# EAGLE design HM_SHT21 (EAGLE 9.5.0)
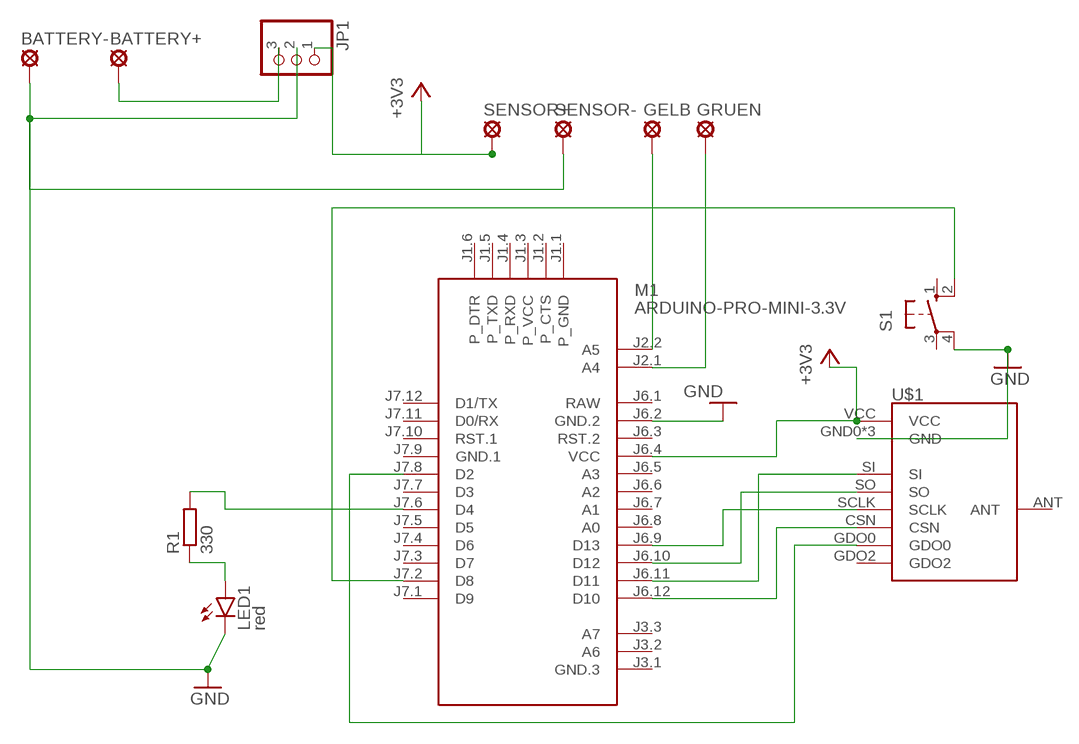
[diagram p0: schematic, sheet 1]

## Parts
BATTERY+  LSP11  [LSP11]
BATTERY-  LSP11  [LSP11]
GELB  LSP11  [LSP11]
GRUEN  LSP11  [LSP11]
JP1  PINHD-1X3  [1X03]
LED1  red  LED5MM  [LED5MM]
M1  ARDUINO-PRO-MINI-3.3V  [ARDUINO-PRO-MINI]
R1  330  R-EU_0204/7  [0204/7]
S1  10-XX  [B3F-10XX]
SENSOR+  LSP11  [LSP11]
SENSOR-  LSP11  [LSP11]
U$1  CC1101  [CC1101]

## Nets
+3V3: JP1.1 M1.J6.4(VCC) SENSOR+.MP U$1.VCC
GND: BATTERY-.MP JP1.2 LED1.K(C) M1.J6.2(GND.2) S1.4(P1) SENSOR-.MP U$1.GND0(GND) U$1.GND1(GND) U$1.GND2(GND)
N$1: M1.J6.12(D10) U$1.CSN
N$2: M1.J7.8(D2) U$1.GDO0
N$3: M1.J6.11(D11) U$1.SI
N$4: M1.J6.10(D12) U$1.SO
N$5: M1.J6.9(D13) U$1.SCLK
N$7: LED1.A R1.1
N$8: M1.J7.2(D8) S1.2(S1)
N$9: M1.J7.6(D4) R1.2
N$11: GELB.MP M1.J2.2(A5)
N$12: GRUEN.MP M1.J2.1(A4)
VIN: BATTERY+.MP JP1.3
Unconnected: M1.J1.1(P_GND) M1.J1.2(P_CTS) M1.J1.3(P_VCC) M1.J1.4(P_RXD) M1.J1.5(P_TXD) M1.J1.6(P_DTR) M1.J3.1(GND.3) M1.J3.2(A6) M1.J3.3(A7) M1.J6.3(RST.2) M1.J6.5(A3) M1.J6.6(A2) M1.J6.7(A1) M1.J6.8(A0) M1.J7.1(D9) M1.J7.3(D7) M1.J7.4(D6) M1.J7.5(D5) M1.J7.7(D3) M1.J7.10(RST.1) M1.J7.11(D0/RX) M1.J7.12(D1/TX) S1.1(S) S1.3(P) U$1.ANT U$1.GDO2

## Power pins joined to a net without a drawn wire
GND.1: M1.J7.9(GND.1)
RAW: M1.J6.1(RAW)

## Library data of the parts
BATTERY+ BATTERY- GELB GRUEN SENSOR+ SENSOR- = solpad:LSP11: SOLDER PAD drill 1.1 mm
JP1 = pinhead:PINHD-1X3: PIN HEADER
LED1 = led:LED: LED OSRAM: - CHIPLED LG R971, LG N971, LY N971, LG Q971, LY Q971, LO R971, LY R971 LH N974, LH R974 LS Q976, LO Q976, LY Q976 LO Q996 - Hyper CHIPLED LW Q18S LB Q993, LB Q99A, LB R99A - SideLED LS A670, LO A670, LY A670, LG A670, LP A670 LB A673, LV A673, LT A673, LW A673 LH A674 LY A675 LS A676, LA A676, LO A676, LY A676, LW A676 LS A679, LY A679, LG A679 - Hyper Micro SIDELED® LS Y876, LA Y876, LO Y876, LY Y876 LT Y87S - SmartLED LW L88C, LW L88S LB L89C, LB L89S, LG L890 LS L89K, LO L89K, LY L89K LS L896, LA L896, LO L896, LY L896 - TOPLED LS T670, LO T670, LY T670, LG T670, LP T670 LSG T670, LSP T670, LSY T670, LOP T670, LYG T670 LG T671, LOG T671, LSG T671 LB T673, LV T673, LT T673, LW T673 LH T674 LS T676, LA T676, LO T676, LY T676, LB T676, LH T676, LSB T676, LW T676 LB T67C, LV T67C, LT T67C, LS T67K, LO T67K, LY T67K, LW E67C LS E67B, LA E67B, LO E67B, LY E67B, LB E67C, LV E67C, LT E67C LW T67C LS T679, LY T679, LG T679 LS T770, LO T770, LY T770, LG T770, LP T770 LB T773, LV T773, LT T773, LW T773 LH T774 LS E675, LA E675, LY E675, LS T675 LS T776, LA T776, LO T776, LY T776, LB T776 LHGB T686 LT T68C, LB T68C - Hyper Mini TOPLED® LB M676 - Mini TOPLED Santana® LG M470 LS M47K, LO M47K, LY M47K Source: http://www.osram.convergy.de LUXEON: - LUMILED® LXK2-PW12-R00, LXK2-PW12-S00, LXK2-PW14-U00, LXK2-PW14-V00 LXK2-PM12-R00, LXK2-PM12-S00, LXK2-PM14-U00 LXK2-PE12-Q00, LXK2-PE12-R00, LXK2-PE12-S00, LXK2-PE14-T00, LXK2-PE14-U00 LXK2-PB12-K00, LXK2-PB12-L00, LXK2-PB12-M00, LXK2-PB14-N00, LXK2-PB14-P00, LXK2-PB14-Q00 LXK2-PR12-L00, LXK2-PR12-M00, LXK2-PR14-Q00, LXK2-PR14-R00 LXK2-PD12-Q00, LXK2-PD12-R00, LXK2-PD12-S00 LXK2-PH12-R00, LXK2-PH12-S00 LXK2-PL12-P00, LXK2-PL12-Q00, LXK2-PL12-R00 Source: www.luxeon.com KINGBRIGHT: KA-3528ASYC Source: www.kingbright.com
M1 = diy-modules:ARDUINO-PRO-MINI-*: Arduino Pro Mini and compatible devices More details available here: https://www.arduino.cc/en/Main/ArduinoBoardProMini Click here to find device on ebay.com <http://www.ebay.com/sch/arduino+pro+mini>
R1 = rcl:R-EU_: RESISTOR, European symbol; SPICEPREFIX: R
S1 = switch-omron:10-XX: OMRON SWITCH; MPN: B3F-1000; OC_FARNELL: 176432; OC_NEWARK: 36M3542
U$1 = modules:CC1101

## Net classes
0 default: clearance 0.205 mm

## Board
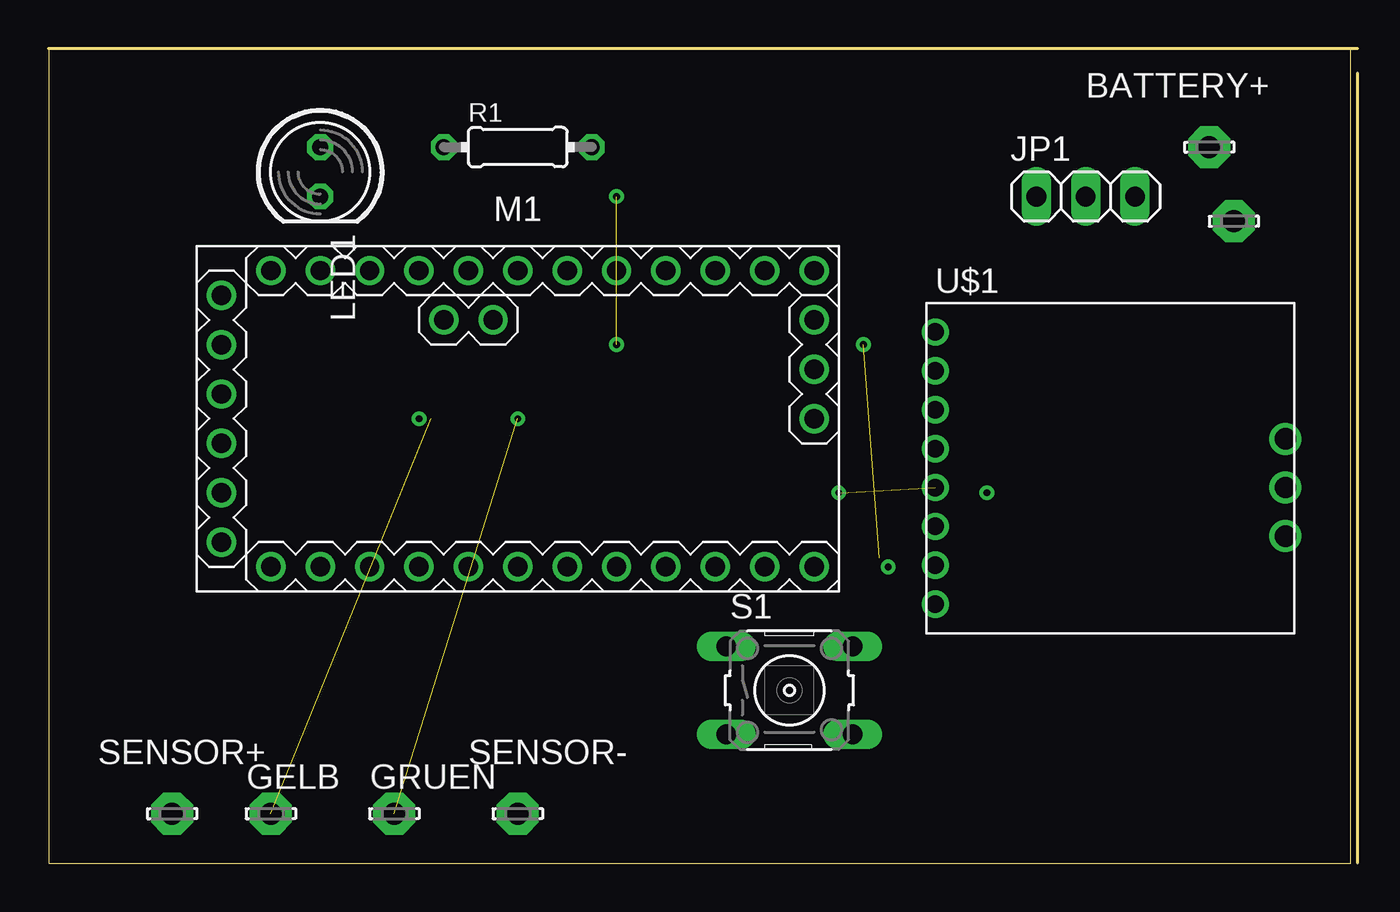
[diagram p1: board, top side]
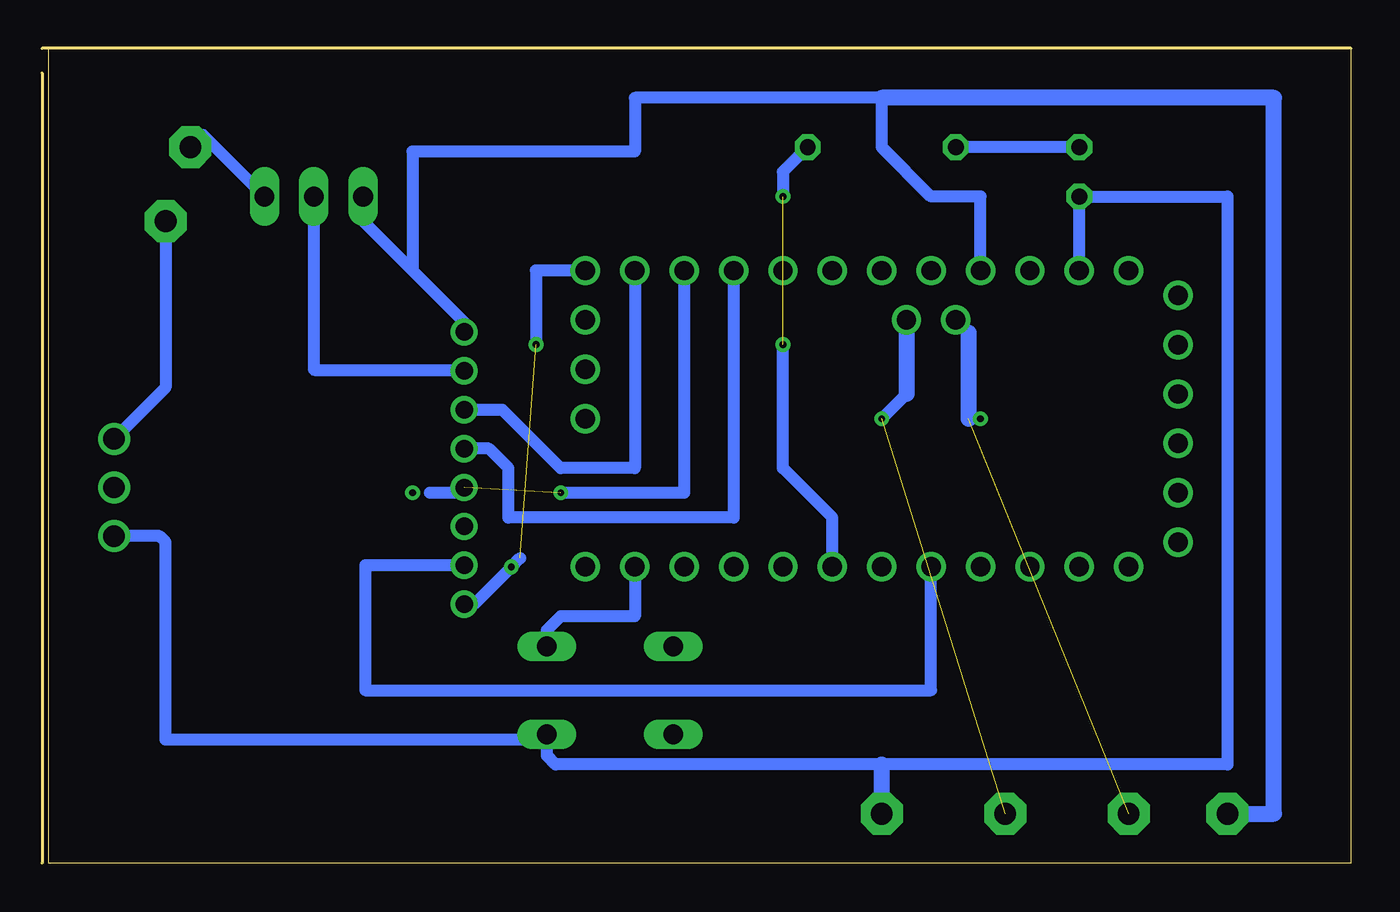
[diagram p2: board, bottom side, seen from below]

Size 66.98 x 41.9 mm. Coordinates in mm from the lower left corner, seen from the top.
Outline: 0,0 66.98,0 66.98,41.9 0,41.9 0,0
Copper layers (1*16): Top 0.035mm / dielectric 1.5mm / Bottom 0.035mm
Design rules "default *": minimum track width 6mil, minimum drill 0.35mm, track to track 10mil, track to pad 10mil, pad to pad 10mil, via to via 10mil, smd to smd 6mil, copper to edge 40mil, drill to drill 6mil, minimum pad ring 10mil, minimum via ring 8mil, stop-mask expansion 4mil, vias tented up to drill 0mil, thermal gap 10mil
Milling: 2 lines

### Footprints (pad centres in the part's own frame; a part is rotated, then mirrored left to right if it is on the bottom)
LSP11 = drill 1.118 pad 2.159 octagon: MP 0,0
1X03 = drill 1.016 long: 1 -2.54,0; 2 0,0; 3 2.54,0
LED5MM = drill 0.813 octagon: A -1.27,0; K 1.27,0
ARDUINO-PRO-MINI = drill 1: J1.1 -15.24,6.35; J1.2 -15.24,3.81; J1.3 -15.24,1.27; J1.4 -15.24,-1.27; J1.5 -15.24,-3.81; J1.6 -15.24,-6.35; J2.1 -1.27,5.08; J2.2 -3.81,5.08; J3.1 15.24,0; J3.2 15.24,2.54; J3.3 15.24,5.08; J6.1 -12.7,7.62; J6.2 -10.16,7.62; J6.3 -7.62,7.62; J6.4 -5.08,7.62; J6.5 -2.54,7.62; J6.6 0,7.62; J6.7 2.54,7.62; J6.8 5.08,7.62; J6.9 7.62,7.62; J6.10 10.16,7.62; J6.11 12.7,7.62; J6.12 15.24,7.62; J7.1 15.24,-7.62; J7.2 12.7,-7.62; J7.3 10.16,-7.62; J7.4 7.62,-7.62; J7.5 5.08,-7.62; J7.6 2.54,-7.62; J7.7 0,-7.62; J7.8 -2.54,-7.62; J7.9 -5.08,-7.62; J7.10 -7.62,-7.62; J7.11 -10.16,-7.62; J7.12 -12.7,-7.62
0204/7 = drill 0.813 octagon: 1 -3.81,0; 2 3.81,0
B3F-10XX = drill 1.016 long: 1 -3.251,2.261; 2 3.251,2.261; 3 -3.251,-2.261; 4 3.251,-2.261
CC1101 = drill 1.1: ANT 9,-1; GND1 9,-3.5; GND2 9,1.5 | drill 0.9: CSN -9,-7; GDO0 -9,-5; GDO2 -9,-3; GND0 -9,5; SCLK -9,1; SI -9,3; SO -9,-1; VCC -9,7

### Placement (x,y rotation side)
BATTERY+  59.69,36.83 0 top
BATTERY-  60.96,33.02 0 top
GELB  11.43,2.54 0 top
GRUEN  17.78,2.54 0 top
JP1  53.34,34.29 0 top
LED1  13.97,35.56 270 top
M1  24.13,22.86 0 top
R1  24.13,36.83 0 top
S1  38.1,8.89 0 top
SENSOR+  6.35,2.54 0 top
SENSOR-  24.13,2.54 0 top
U$1  54.61,20.32 0 top

### Tracks (layer width: path | path; a pad name or v marks a point on that pad's centre or on a via)
+3V3
  Bottom 0.152: 50.79,34.17 JP1.1 | 19.52,30.56 19.16,30.56 M1.J6.4
  Bottom 0.61: U$1.VCC 45.61,27.83 48.26,30.48 | JP1.1 50.8,33.02 48.26,30.48 | M1.J6.4 19.05,34.29 21.59,34.29 24.13,36.83 24.13,39.37 36.83,39.37 36.83,36.61 48.26,36.61 48.26,30.48 | SENSOR+.MP 6.24,2.43
  Bottom 0.813: SENSOR+.MP 3.96,2.54 3.96,39.37 24.13,39.37
GND
  Bottom 0.152: 13.8,30.56 M1.J6.2 13.98,30.38 | 45.73,25.37 U$1.GND0 | 63.44,21.98 U$1.GND2
  Bottom 0.61: M1.J6.2 LED1.K 6.35,34.29 6.35,5.08 24.13,5.08 40.9,5.08 41.35,5.54 S1.4 41.63,6.35 60.96,6.35 60.96,16.51 61.25,16.8 61.27,16.82 U$1.GND1 | BATTERY-.MP 60.96,24.47 U$1.GND2 | JP1.2 53.34,25.4 53.31,25.37 45.73,25.37
  Bottom 0.813: SENSOR-.MP 24.13,5.08
N$1  (via drill 0.35)  (1 unrouted)
  Bottom 0.152: 39.35,30.56 M1.J6.12
  Bottom 0.61: U$1.CSN 45.1,13.32 v43.18,15.24 42.73,15.7 | M1.J6.12 41.91,30.48 v41.91,26.67
N$2
  Bottom 0.61: U$1.GDO0 50.69,15.32 50.69,8.89 21.59,8.89 M1.J7.8
N$3
  Bottom 0.61: M1.J6.11 36.83,20.32 40.64,20.32 43.64,23.32 U$1.SI
N$4  (via drill 0.35)  (1 unrouted)
  Bottom 0.152: 34.17,30.56 M1.J6.10
  Bottom 0.61: M1.J6.10 34.29,19.05 v40.64,19.05 | U$1.SO 45.88,19.05 47.37,19.05
N$5
  Bottom 0.61: M1.J6.9 31.75,17.78 43.33,17.78 43.33,20.32 44.33,21.32 U$1.SCLK
N$6  (via drill 0.35)
  other vias: 48.26,19.05
N$7
  Bottom 0.152: 20.23,36.81 R1.1
  Bottom 0.61: LED1.A R1.1
N$8
  Bottom 0.152: 37.39,15.19 36.85,15.19 M1.J7.2 | 41.28,11.3 S1.2
  Bottom 0.61: M1.J7.2 36.83,12.7 40.64,12.7 41.35,11.99 S1.2
N$9  (via drill 0.35)  (1 unrouted)
  Bottom 0.152: 28.09,36.81 R1.2 | 26.84,15.37 M1.J7.6
  Bottom 0.61: M1.J7.6 26.67,17.78 29.21,20.32 v29.21,26.67 | R1.2 29.21,35.56 v29.21,34.29
N$10  (via drill 0.35)
  other vias: 19.05,22.86
N$11  (1 unrouted)
  Bottom 0.152: M1.J2.2 19.66,27.28
  Bottom 0.813: 19.66,27.28 19.66,22.86
N$12  (via drill 0.35)  (1 unrouted)
  Bottom 0.61: 22.86,24.13 v24.13,22.86
  Bottom 0.813: M1.J2.1 22.86,24.13
VIN
  Bottom 0.152: 55.97,34.17 JP1.3
  Bottom 0.61: JP1.3 59.05,37.47 BATTERY+.MP